# Altium project IPM.PrjPcb
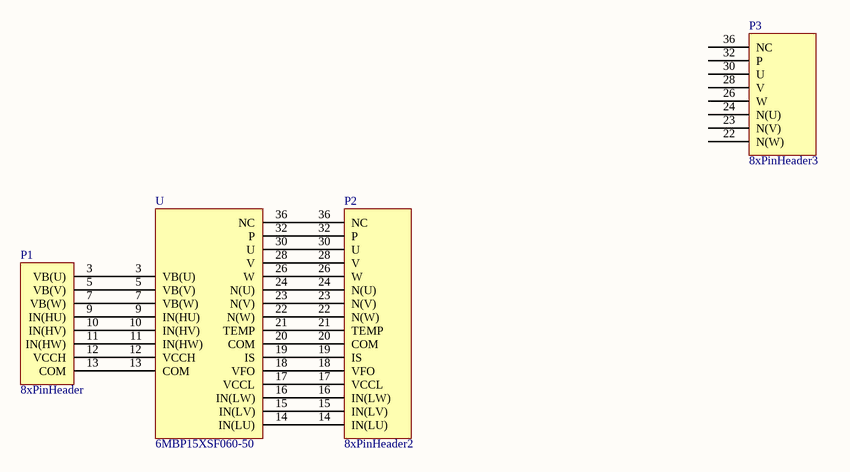
[diagram p0: Sheet2.SchDoc]
1 sheet, 4 parts. Net scope: global (net labels, ports and power ports of the same name join across sheets).
Board file: IPM.PcbDoc

## Sheet Sheet2.SchDoc
size A4

### Parts
P1  8xPinHeader  [8xPinHeader]
P2  8xPinHeader2  [8xPinHeader2]
P3  8xPinHeader3  [8xPinHeader3]
U  6MBP15XSF060-50  [6MBP15XSF060-50]

### Nets
NetP1_3: P1.3(VB(U)) U.3(VB(U))
NetP1_5: P1.5(VB(V)) U.5(VB(V))
NetP1_7: P1.7(VB(W)) U.7(VB(W))
NetP1_9: P1.9(IN(HU)) U.9(IN(HU))
NetP1_10: P1.10(IN(HV)) U.10(IN(HV))
NetP1_11: P1.11(IN(HW)) U.11(IN(HW))
NetP1_12: P1.12(VCCH) U.12(VCCH)
NetP1_13: P1.13(COM) U.13(COM)
NetP2_14: P2.14(IN(LU)) U.14(IN(LU))
NetP2_15: P2.15(IN(LV)) U.15(IN(LV))
NetP2_16: P2.16(IN(LW)) U.16(IN(LW))
NetP2_17: P2.17(VCCL) U.17(VCCL)
NetP2_18: P2.18(VFO) U.18(VFO)
NetP2_19: P2.19(IS) U.19(IS)
NetP2_20: P2.20(COM) U.20(COM)
NetP2_21: P2.21(TEMP) U.21(TEMP)
NetP2_22: P2.22(N(W)) U.22(N(W))
NetP2_23: P2.23(N(V)) U.23(N(V))
NetP2_24: P2.24(N(U)) U.24(N(U))
NetP2_26: P2.26(W) U.26(W)
NetP2_28: P2.28(V) U.28(V)
NetP2_30: P2.30(U) U.30(U)
NetP2_32: P2.32(P) U.32(P)
NetP2_36: P2.36(NC) U.36(NC)

Not connected (* = marked no-connect by the designer): P3 22(N(W)) 23(N(V)) 24(N(U)) 26(W) 28(V) 30(U) 32(P) 36(NC)

### Library data of the parts
U = 6MBP15XSF060-50: 600v 15a